# EAGLE design main (EAGLE 9.6.2)
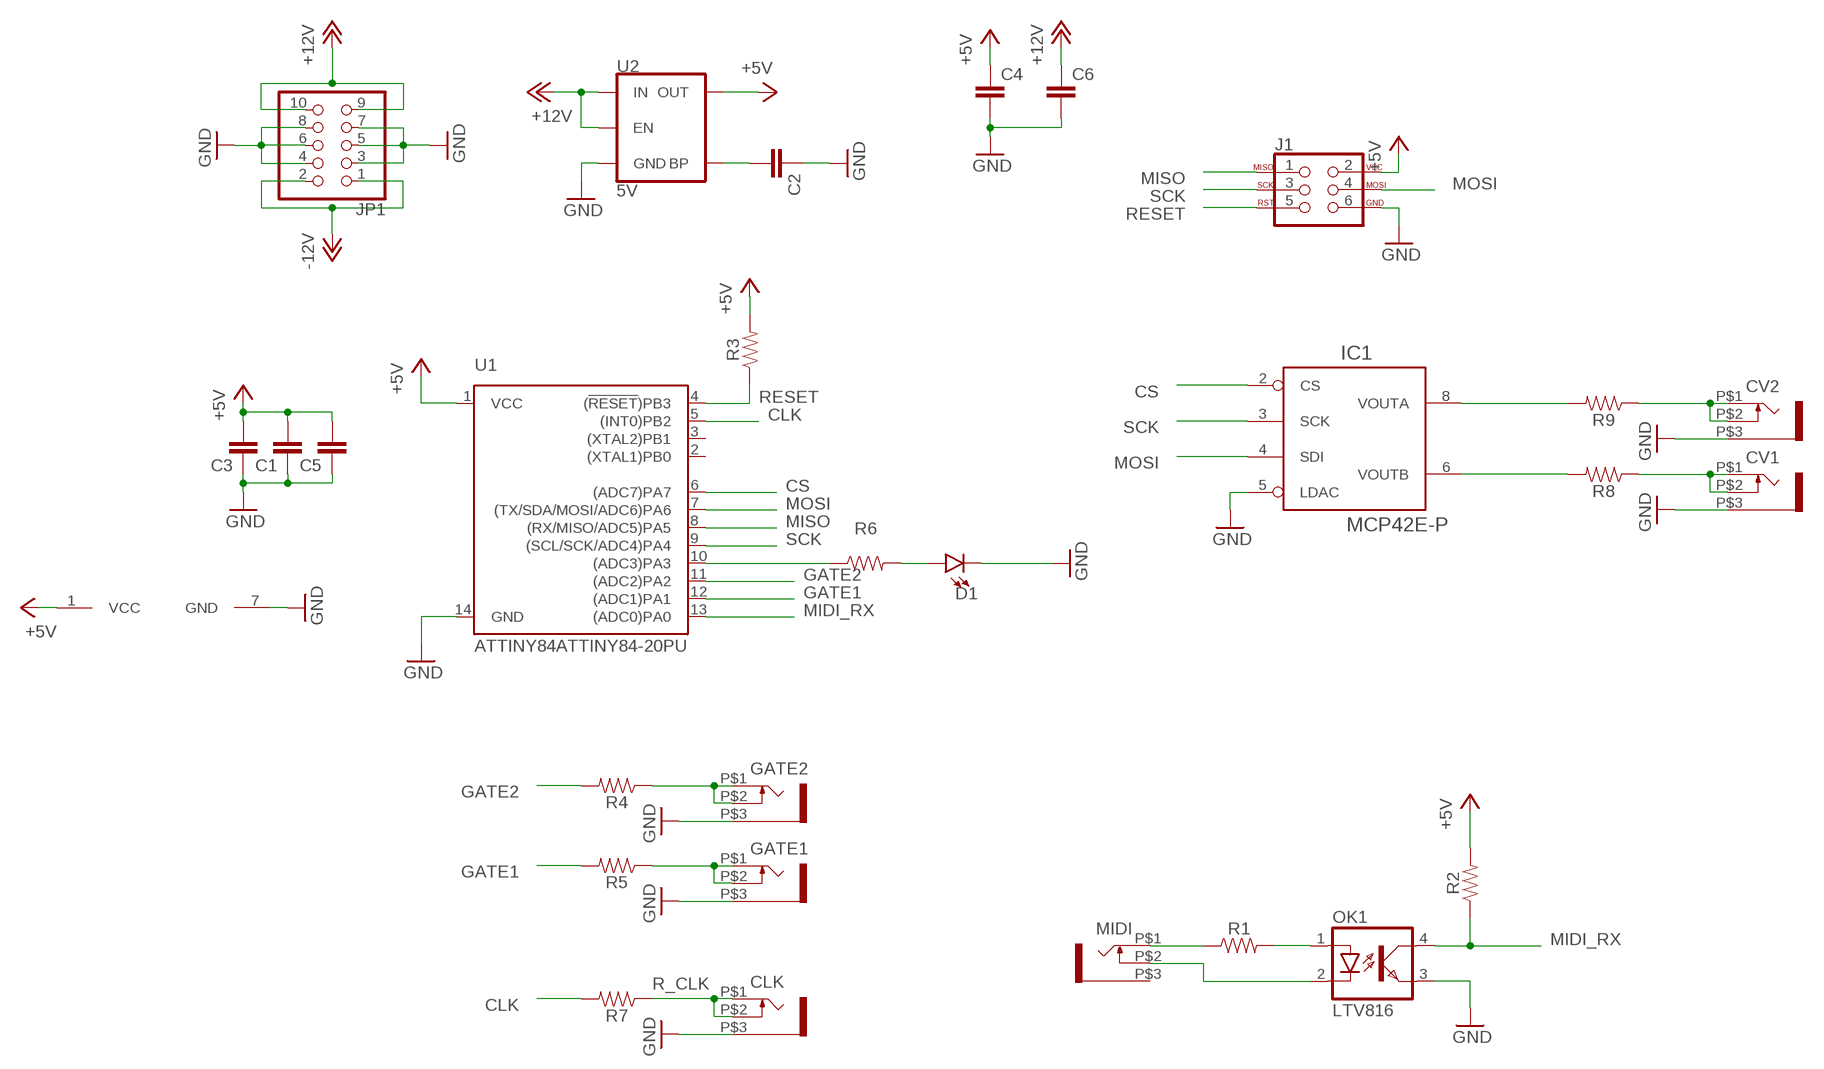
[diagram p0: schematic, sheet 1]

## Parts
C1  CAP-0603  [0603]
C2  CAP-0603  [0603]
C3  CAP-0603  [0603]
C4  CAP-0805  [0805]
C5  CAP-0603  [0603]
C6  CAP-0805  [0805]
CLK  WQP-PJ301M-12_JACK  [WQP-PJ301M-12_JACK]
CV1  WQP-PJ301M-12_JACK  [WQP-PJ301M-12_JACK]
CV2  WQP-PJ301M-12_JACK  [WQP-PJ301M-12_JACK]
D1  LED3MM  [LED_3MM]
GATE1  WQP-PJ301M-12_JACK  [WQP-PJ301M-12_JACK]
GATE2  WQP-PJ301M-12_JACK  [WQP-PJ301M-12_JACK]
IC1  MCP42E-P  [DIL08]
J1  AVR_SPI_PROG_3X2PTH  [2X3]
JP1  PINHD-2X5  [2X05]
MIDI  WQP-PJ301M-12_JACK  [WQP-PJ301M-12_JACK]
OK1  LTV816  [DIL04]
R1  RESISTORAXIAL-0.3  [AXIAL-0.3]
R2  RESISTORAXIAL-0.3  [AXIAL-0.3]
R3  RESISTOR0603  [0603]
R4  RESISTOR0603  [0603]
R5  RESISTOR0603  [0603]
R6  RESISTOR0603  [0603]
R7  RESISTOR0603  [0603]
R8  RESISTOR0603  [0603]
R9  RESISTOR0603  [0603]
U1  ATTINY84ATTINY84-20PU  [DIP14]
U2  5V  V_REG_MIC52055V  [SOT23-5]

## Nets
+5V: C1.2 C3.2 C4.1 C5.2 IC1.1(VCC) J1.2 R2.P$2 R3.2 U1.1(VCC) U2.5(OUT)
+12V: C6.1 JP1.9 JP1.10 U2.1(IN) U2.3(EN)
-12V: JP1.1 JP1.2
CLK: R7.2 U1.5((INT0)PB2)
CS: IC1.2(CS) U1.6((ADC7)PA7)
GATE1: R5.2 U1.12((ADC1)PA1)
GATE2: R4.2 U1.11((ADC2)PA2)
GND: C1.1 C2.1 C3.1 C4.2 C5.1 C6.2 CLK.P$3 CV1.P$3 CV2.P$3 D1.K(C) GATE1.P$3 GATE2.P$3 IC1.5(LDAC) IC1.7(GND) J1.6 JP1.3 JP1.4 JP1.5 JP1.6 JP1.7 JP1.8 OK1.3(EMIT) U1.14(GND) U2.2(GND)
MIDI_RX: OK1.4(COL) R2.P$1 U1.13((ADC0)PA0)
MISO: J1.1 U1.8((RX/MISO/ADC5)PA5)
MOSI: IC1.4(SDI) J1.4 U1.7((TX/SDA/MOSI/ADC6)PA6)
N$1: MIDI.P$1 R1.P$1
N$2: OK1.1(A) R1.P$2
N$3: MIDI.P$2 OK1.2(C)
N$4: IC1.8(VOUTA) R9.2
N$5: IC1.6(VOUTB) R8.2
N$6: CV1.P$1 CV1.P$2 R8.1
N$7: R6.1 U1.10((ADC3)PA3)
N$9: D1.A R6.2
N$10: C2.2 U2.4(BP)
N$11: CV2.P$1 CV2.P$2 R9.1
R_CLK: CLK.P$1 CLK.P$2 R7.1
R_GATE1: GATE1.P$1 GATE1.P$2 R5.1
R_GATE2: GATE2.P$1 GATE2.P$2 R4.1
RESET: J1.5 R3.1 U1.4((!RESET!)PB3)
SCK: IC1.3(SCK) J1.3 U1.9((SCL/SCK/ADC4)PA4)
Unconnected: MIDI.P$3 U1.2((XTAL1)PB0) U1.3((XTAL2)PB1)

## Library data of the parts
C1-C6 = SparkFun-Capacitors:CAP
CLK CV1 CV2 GATE1 GATE2 MIDI = thonkiconn:WQP-PJ301M-12_JACK
D1 = SparkFun-LED:LED: LED (Generic) Standard schematic elements and footprints for 5mm, 3mm, 1206, and 0603 sized LEDs. Generic LEDs with no color specified.; PROD_ID: DIO-08794
IC1 = dac:MCP4*2: DAC 8BIT DUAL SPI/VREF
J1 = SparkFun-Connectors:AVR_SPI_PROG_3X2: AVR ISP 6 Pin This is the reduced ISP connector for AVR programming. Common on Arduino. This footprint will take up less PCB space and can be used with a 10-pin to 6-pin adapter such as SKU: BOB-08508 **Special note about "TEST_POINT" package. The stop mask is on the top side, so if you want your programming test points to be on the bottom of your board, make sure to place this package on the bottom side of the board. This also ensure that the orientation to program from the bottom side will be correct. SparkFun Products: SparkFun ISP Pogo Adapter <https://www.sparkfun.com/products/11591> - NS Tiny AVR Programmer <https://www.sparkfun.com/products/11801> -PTH
JP1 = pinhead:PINHD-2X5: PIN HEADER
OK1 = optocoupler:LTV816: OPTO COUPLER Source: LITEON, LTV816.pdf; OC_FARNELL: unknown; OC_NEWARK: unknown
R1-R9 = SparkFun-Resistors:RESISTOR: Generic Resistor Package
U1 = SparkFun-IC-Microcontroller:ATTINY84: Atmel 14-pin 2/4/8kB flash uC Datasheet <https://cdn.sparkfun.com/datasheets/Widgets/doc8006.pdf> SparkFun Products Tiny AVR Programmer <https://www.sparkfun.com/products/11801> (PGM-11801) SparkFun Servo Trigger - Continuous Rotation <https://www.sparkfun.com/products/13872> (WIG-13872) SparkFun Servo Trigger <https://www.sparkfun.com/products/13118> (WIG-13118)
U2 = SparkFun-IC-Power:V_REG_MIC5205: V_REG MIC5205 Standard 3.3V, 5V, and Adjustable 150mA LDO voltage regulator in SOT-23 layout. Micrel part MIC5205. BP (by-pass) pin is used to lower output noise with 470pF cap, may be left open. On the adjustable version BP is used to set output.; PROD_ID: VREG-00823

## Board
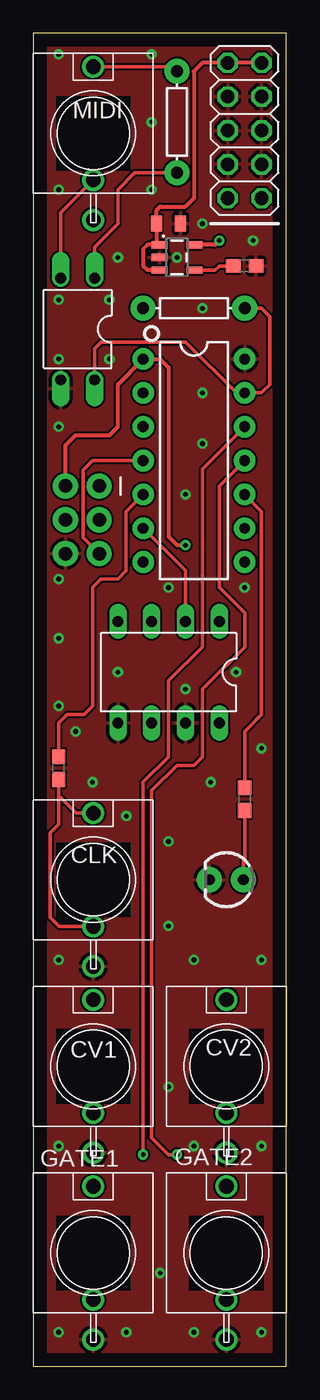
[diagram p1: board, top side]
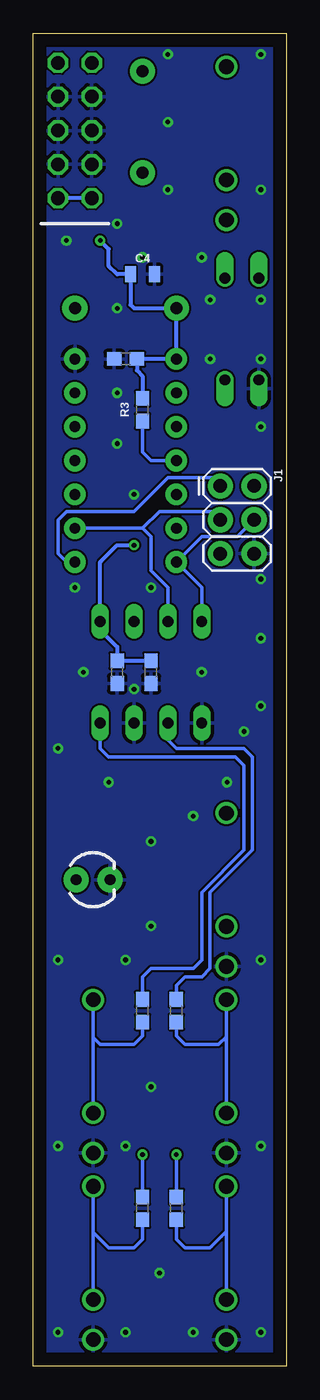
[diagram p2: board, bottom side, seen from below]

Size 19 x 100 mm. Coordinates in mm from the lower left corner, seen from the top.
Outline: 0,0 19,0 19,100 0,100 0,0
Copper layers (1*16): Top 0.035mm / dielectric 1.5mm / Bottom 0.035mm
Design rules "default": minimum track width 6mil, minimum drill 0.35mm, track to track 6mil, track to pad 6mil, pad to pad 6mil, via to via 6mil, smd to smd 6mil, copper to edge 40mil, drill to drill 6mil, minimum pad ring 10mil, minimum via ring 8mil, stop-mask expansion 4mil, vias tented up to drill 0mil, thermal gap 10mil

### Footprints (pad centres in the part's own frame; a part is rotated, then mirrored left to right if it is on the bottom)
0603 = smd 1.1 x 1: 1 -0.85,0; 2 0.85,0
0805 = smd 0.8 x 1.2: 1 -0.9,0; 2 0.9,0
WQP-PJ301M-12_JACK = drill 1.1: P$1 0,5; P$2 0,-3.5; P$3 0,-6.5
LED_3MM = drill 0.813 pad 1.88: A -1.27,0; K 1.27,0
DIL08 = drill 0.813 long: 1 -3.81,-3.81; 2 -1.27,-3.81; 3 1.27,-3.81; 4 3.81,-3.81; 5 3.81,3.81; 6 1.27,3.81; 7 -1.27,3.81; 8 -3.81,3.81
2X3 = drill 1.016 pad 1.88: 1 0,0; 2 0,2.54; 3 2.54,0; 4 2.54,2.54; 5 5.08,0; 6 5.08,2.54
2X05 = drill 1.016 octagon: 1 -5.08,-1.27; 2 -5.08,1.27; 3 -2.54,-1.27; 4 -2.54,1.27; 5 0,-1.27; 6 0,1.27; 7 2.54,-1.27; 8 2.54,1.27; 9 5.08,-1.27; 10 5.08,1.27
DIL04 = drill 0.813 offset: 1 -1.27,-3.81; 2 1.27,-3.81; 3 1.27,3.81; 4 -1.27,3.81
AXIAL-0.3 = drill 0.9 pad 1.88: P$1 -3.81,0; P$2 3.81,0
DIP14 = drill 0.813 pad 1.626: 1 -7.62,-3.81; 2 -5.08,-3.81; 3 -2.54,-3.81; 4 0,-3.81; 5 2.54,-3.81; 6 5.08,-3.81; 7 7.62,-3.81; 8 7.62,3.81; 9 5.08,3.81; 10 2.54,3.81; 11 0,3.81; 12 -2.54,3.81; 13 -5.08,3.81; 14 -7.62,3.81
SOT23-5 = smd 0.55 x 1.2: 1 -0.95,-1.3; 2 0,-1.3; 3 0.95,-1.3; 4 0.95,1.3; 5 -0.95,1.3

### Placement (x,y rotation side)
C1  12.7,52.07 90 bottom
C2  15.88,82.55 180 top
C3  12.06,75.56 0 bottom
C4  10.79,81.92 0 bottom
C5  10.16,52.07 90 bottom
C6  10.16,85.72 0 top
CLK  4.5,36.5 0 top
CV1  4.5,22.5 0 top
CV2  14.5,22.5 0 top
D1  14.5,36.5 180 top
GATE1  4.5,8.5 0 top
GATE2  14.5,8.5 0 top
IC1  10.16,52.07 180 top
J1  4.95,66.04 270 bottom
JP1  15.88,92.71 90 top
MIDI  4.5,92.5 0 top
OK1  3.33,77.81 180 top
R1  10.79,93.34 270 top
R2  12.06,79.38 180 top
R3  10.79,71.75 90 bottom
R4  10.79,11.85 90 bottom
R5  8.26,11.85 90 bottom
R6  15.88,42.55 270 top
R7  1.91,44.87 90 top
R8  8.26,26.67 90 bottom
R9  10.79,26.67 90 bottom
U1  12.06,67.94 270 top
U2  10.79,83.19 270 top

### Tracks (layer width: path | path; a pad name or v marks a point on that pad's centre or on a via)
+5V  (via drill 0.35)
  Top 0.305: v13.97,84.45 13.65,84.14 U2.5 | v11.43,61.59 10.79,61.59 10.16,62.23 10.16,74.93 9.53,75.56 U1.1 6.35,73.66 6.35,70.48 5.71,69.85 3.17,69.85 2.41,69.09 J1.2
  Bottom 0.305: v11.43,61.59 12.7,61.59 13.97,60.33 IC1.1 13.97,55.24 12.7,53.98 C1.2 C5.2 | v13.97,84.45 13.34,83.82 13.34,82.55 12.7,81.92 C4.1 11.7,79.64 11.43,79.38 R2.P$2 U1.1 C3.2 11.21,74.72 10.79,74.3 R3.2
+12V
  Top 0.254: 9.26,84.37 U2.1 | 8.57,84.14 8.26,83.82
  Top 0.305: JP1.9 JP1.10 12.7,97.79 12.06,97.16 12.06,87.63 11.43,87 9.53,87 9.26,86.73 C6.1 9.26,84.37 | U2.3 8.57,82.23 8.26,82.55 8.26,83.82 | U2.1 8.57,84.14
-12V
  Bottom 0.305: JP1.2 JP1.1
CLK
  Top 0.254: U1.5 6.99,64.14 6.99,59.69 6.35,59.05 5.08,59.05 4.45,58.42 4.45,49.53 3.81,48.9 2.54,48.9 1.91,48.26 R7.2
CS
  Top 0.254: IC1.2 11.43,59.69 U1.6
GATE1  (via drill 0.35)
  Top 0.254: v8.26,15.88 8.26,43.81 10.16,45.72 10.16,51.44 12.7,53.98 12.7,67.31 U1.12
  Bottom 0.254: R5.2 v8.26,15.88
GATE2  (via drill 0.35)
  Top 0.254: U1.11 13.97,66.04 13.97,58.42 15.88,56.52 15.88,53.98 12.7,50.8 12.7,45.72 12.06,45.09 10.79,45.09 8.89,43.18 8.89,17.14 10.16,15.88 v10.79,15.88
  Bottom 0.254: R4.2 v10.79,15.88
GND  (via drill 0.35)
  other vias: 1.91,98.42 8.89,98.42 8.89,88.27 8.89,93.34 1.91,88.27 6.35,83.19 10.79,83.19 12.7,85.72 16.51,84.45 12.7,79.38 5.71,80.01 5.71,75.56 1.91,75.56 1.91,80.01 1.91,59.05 1.91,49.53 1.91,54.61 6.35,52.07 11.43,50.8 15.24,52.07 11.43,65.41 10.16,58.42 12.7,69.22 12.7,73.03 1.91,70.48 4.45,43.81 3.17,47.62 1.91,30.48 1.91,16.51 1.91,2.54 6.99,2.54 17.14,2.54 17.14,16.51 17.14,30.48 12.06,30.48 12.06,16.51 12.06,2.54 9.53,6.99 10.16,20.95 10.16,33.02 6.99,41.27 10.16,39.37 13.34,43.81 17.14,46.35 15.88,58.42
  pour Top: 19.68,100.33 19.68,-0.64 -1.27,-0.64 -0.64,100.33
  pour Bottom: -1.27,100.97 20.32,100.97 20.32,83.82 20.32,-1.27 -1.27,-1.27
MIDI_RX
  Top 0.254: R2.P$1 17.14,79.38 17.78,78.74 17.78,73.66 17.14,73.03 U1.13 15.24,73.03 11.43,76.83 5.08,76.83 4.6,76.36 OK1.4
MISO
  Bottom 0.254: U1.8 16.51,60.33 17.14,60.96 17.14,63.5 16.51,64.14 11.43,64.14 8.89,66.67 5.59,66.67 J1.1
MOSI
  Bottom 0.254: IC1.4 6.35,58.42 U1.7 6.35,62.23 3.68,62.23 J1.4
N$1
  Top 0.254: MIDI.P$1 10.45,97.5 R1.P$1
N$2
  Top 0.254: OK1.1 4.6,83.97 6.35,85.72 6.35,88.27 7.62,89.53 R1.P$2
N$3
  Top 0.254: OK1.2 2.06,86.56 MIDI.P$2
N$4
  Bottom 0.254: R9.2 10.79,29.21 10.16,29.84 6.99,29.84 6.35,30.48 6.35,35.56 3.17,38.73 3.17,45.09 3.81,45.72 13.34,45.72 13.97,46.35 IC1.8
N$5
  Bottom 0.254: R8.2 8.26,28.57 7.62,29.21 6.35,29.21 5.71,29.84 5.71,35.56 2.54,38.73 2.54,45.72 3.17,46.35 8.26,46.35 8.89,46.99 IC1.6
N$6
  Bottom 0.254: R8.1 8.26,24.77 7.62,24.13 5.08,24.13 4.5,24.71 | CV1.P$1 4.5,24.71 | CV1.P$2 4.5,24.71
N$7
  Top 0.254: U1.10 17.14,64.14 17.14,48.9 15.88,47.62 R6.1
N$9
  Top 0.254: D1.A 15.77,37.99 15.88,38.1 R6.2
N$10
  Top 0.254: U2.4 13.65,82.23 13.97,82.55 C2.2
N$11
  Bottom 0.254: R9.1 10.79,24.77 11.43,24.13 13.97,24.13 14.5,24.66 | CV2.P$1 14.5,24.66 | CV2.P$2 14.5,24.66
R_CLK
  Top 0.254: R7.1 1.91,42.83 | CLK.P$1 3.23,41.5 1.91,42.83 | 1.91,42.83 1.91,40.64 1.27,40.01 1.27,33.66 1.93,33 CLK.P$2
R_GATE1
  Bottom 0.254: GATE1.P$1 4.5,10.11 | 4.5,10.11 5.71,8.89 7.62,8.89 8.26,9.53 R5.1 | GATE1.P$2 4.5,10.11
R_GATE2
  Bottom 0.254: GATE2.P$1 14.5,10.05 | 14.5,10.05 13.34,8.89 11.43,8.89 10.79,9.53 R4.1 | GATE2.P$2 14.5,10.05
RESET
  Top 0.254: J1.5 3.73,62.18 3.73,67.23 4.45,67.94 U1.4
  Bottom 0.254: U1.4 10.16,67.94 10.79,68.58 R3.1
SCK
  Bottom 0.254: U1.9 10.79,62.87 | 10.79,62.87 9.53,64.14 5.59,64.14 J1.3 | IC1.3 8.89,58.42 10.16,59.69 10.16,62.23 10.79,62.87